# EAGLE schematic NBESlab_tES_Fusion_Schematic (EAGLE 9.7.0)
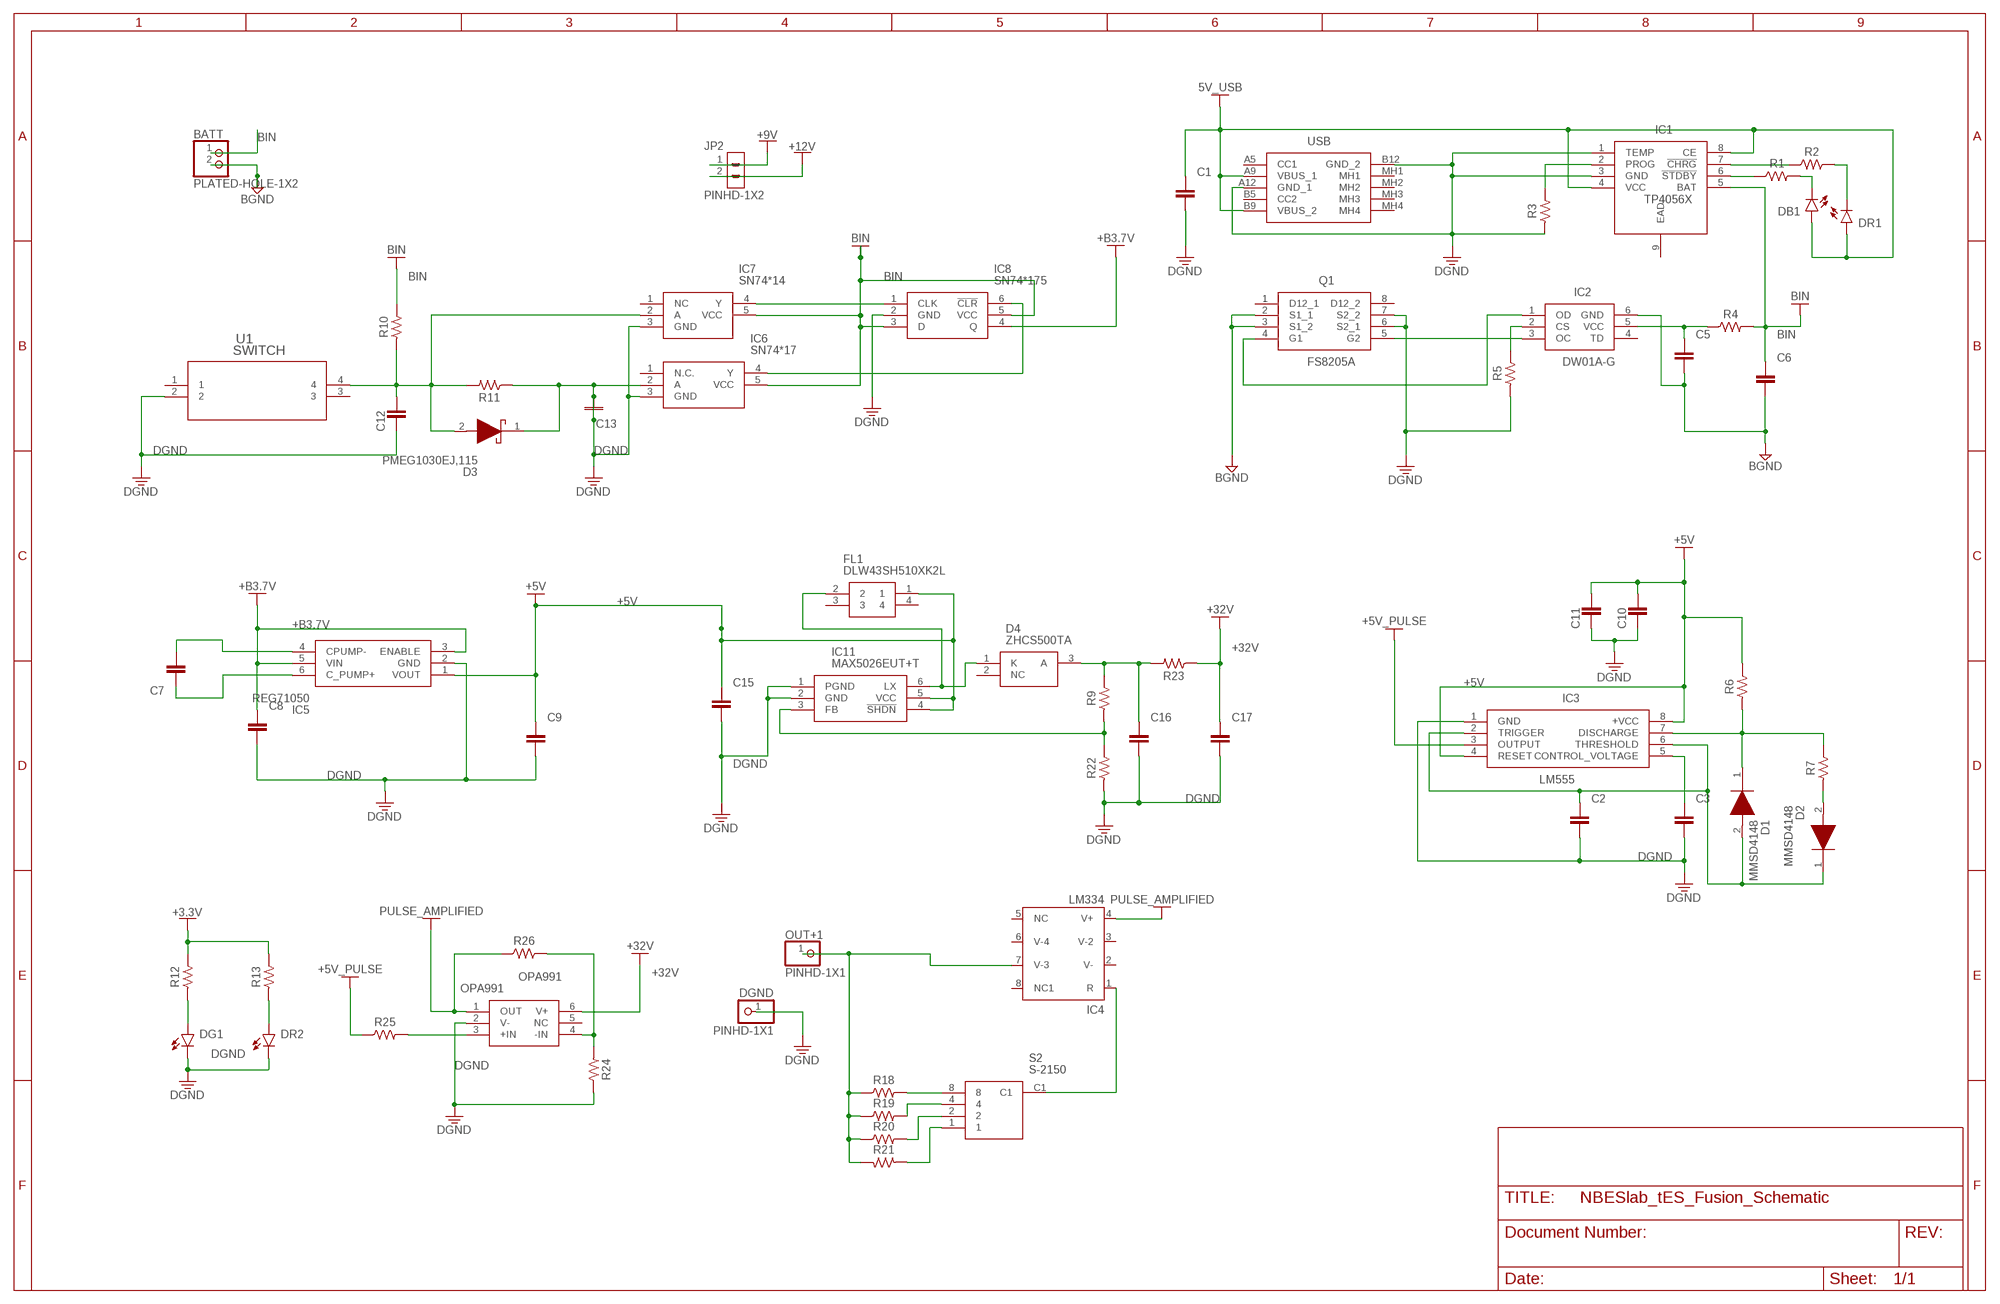
[diagram p0: schematic, sheet 1]

## Parts
BATT  PLATED-HOLE-1X2  [1X02]
C1  C_CHIP-0603(1608-METRIC)  [CAPC1608X85]
C2  C_CHIP-0603(1608-METRIC)  [CAPC1608X85]
C3  C_CHIP-0603(1608-METRIC)  [CAPC1608X85]
C5  C_CHIP-0603(1608-METRIC)  [CAPC1608X85]
C6  C_CHIP-0603(1608-METRIC)  [CAPC1608X85]
C7  C_CHIP-0402(1005-METRIC)  [CAPC1005X60]
C8  C_CHIP-0603(1608-METRIC)  [CAPC1608X85]
C9  C_CHIP-0603(1608-METRIC)  [CAPC1608X85]
C10  C_CHIP-0603(1608-METRIC)  [CAPC1608X85]
C11  C_CHIP-0603(1608-METRIC)  [CAPC1608X85]
C12  C_CHIP-0603(1608-METRIC)  [CAPC1608X85]
C13  C_CHIP-0805(2012-METRIC)  [CAPC2012X110]
C15  C_CHIP-0603(1608-METRIC)  [CAPC1608X85]
C16  C_CHIP-0603(1608-METRIC)  [CAPC1608X85]
C17  C_CHIP-0603(1608-METRIC)  [CAPC1608X85]
D1  MMSD4148  [SOD3716X135N]
D2  MMSD4148  [SOD3716X135N]
D3  PMEG1030EJ,115  [PMEG1030EJ115]
D4  ZHCS500TA  [SOT96P240X110-3N]
DB1  LED_BLUE  CHIP-FLAT-B_0805  [LEDC2012X110N_FLAT-B]
DG1  LED_BLUE  CHIP-FLAT-B_0805  [LEDC2012X110N_FLAT-B]
DGND  PINHD-1X1  [1X01]
DR1  LED_BLUE  CHIP-FLAT-B_0805  [LEDC2012X110N_FLAT-B]
DR2  LED_BLUE  CHIP-FLAT-B_0805  [LEDC2012X110N_FLAT-B]
FL1  DLW43SH510XK2L  [DLW43SH110XK2K]
IC1  TP4056X  [SOIC127P600X175-9N]
IC2  DW01A-G  [SOT95P280X135-6N]
IC3  LM555  LM555CM_NOPB  [SOIC127P600X175-8N]
IC4  LM334  [SO-08]
IC5  REG71050  REG71050DDCR  [SOT95P280X110-6N]
IC6  SN74*17  SN74LVC1G17DBVR  [SOT95P280X145-5N]
IC7  SN74*14  SN74LVC1G14DBVR  [SOT95P280X145-5N]
IC8  SN74*175  SN74LVC1G175DCKRDBVR  [SOT95P280X145-6N]
IC11  MAX5026EUT+T  [SOT95P280X145-6N]
JP2  PINHD-1X2  [1X02]
OPA991  OPA991  OPA991SIDBVROPA991SIDBVR  [SOT95P280X145-6N]
OUT+1  PINHD-1X1  [1X01]
Q1  FS8205A  [SOP65P640X120-8N]
R1  R-US_CHIP-0603(1608-METRIC)  [RESC1608X60]
R2  R-US_CHIP-0603(1608-METRIC)  [RESC1608X60]
R3  R-US_CHIP-0603(1608-METRIC)  [RESC1608X60]
R4  R-US_CHIP-0603(1608-METRIC)  [RESC1608X60]
R5  R-US_CHIP-0603(1608-METRIC)  [RESC1608X60]
R6  R-US_CHIP-0603(1608-METRIC)  [RESC1608X60]
R7  R-US_CHIP-0603(1608-METRIC)  [RESC1608X60]
R9  R-US_CHIP-0603(1608-METRIC)  [RESC1608X60]
R10  R-US_CHIP-0603(1608-METRIC)  [RESC1608X60]
R11  R-US_CHIP-0603(1608-METRIC)  [RESC1608X60]
R12  R-US_CHIP-0603(1608-METRIC)  [RESC1608X60]
R13  R-US_CHIP-0603(1608-METRIC)  [RESC1608X60]
R18  R-US_CHIP-0603(1608-METRIC)  [RESC1608X60]
R19  R-US_CHIP-0603(1608-METRIC)  [RESC1608X60]
R20  R-US_CHIP-0603(1608-METRIC)  [RESC1608X60]
R21  R-US_CHIP-0603(1608-METRIC)  [RESC1608X60]
R22  R-US_CHIP-0603(1608-METRIC)  [RESC1608X60]
R23  R-US_CHIP-0603(1608-METRIC)  [RESC1608X60]
R24  R-US_CHIP-0603(1608-METRIC)  [RESC1608X60]
R25  R-US_CHIP-0603(1608-METRIC)  [RESC1608X60]
R26  R-US_CHIP-0603(1608-METRIC)  [RESC1608X60]
S2  S-2150  [S2150]
U1  SWITCH  1571563-9SWITCH_1571563-9-L  [SWITCH_1571563-9-L]
USB  USB4125-GF-A-0190  [USB4125GFA0190]

## Nets
5V_USB: C1.1 DB1.A DR1.A IC1.4(VCC) IC1.8(CE) USB.A9(VBUS_1) USB.B9(VBUS_2)
+5V: C9.1 C10.1 C11.1 C15.1 FL1.1 IC3.4(RESET) IC3.8(+VCC) IC5.1(VOUT) IC11.4(!SHDN) IC11.5(VCC) JP2.1 R6.2 ; supply symbol labelled +9V
+5V_PULSE: IC3.3(OUTPUT) R25.1
+32V: C17.1 JP2.2 OPA991.6(V+) R23.1 ; supply symbol labelled +12V
+B3.7V: C8.1 IC5.3(ENABLE) IC5.5(VIN) IC8.4(Q) R12.2 R13.2 ; supply symbol labelled +3.3V
BGND: BATT.2 C5.2 C6.2 C10.2 C11.2 IC2.6(GND) Q1.2(S1_1) Q1.3(S1_2) ; supply symbol labelled DGND
BIN: BATT.1 C6.1 IC1.5(BAT) IC6.5(VCC) IC7.5(VCC) IC8.3(D) IC8.5(VCC) R4.2 R10.2
DGND: C1.2 C2.2 C3.2 C8.2 C9.2 C12.2 C13.1 C13.2 C15.2 C16.2 C17.2 D3.1(K) DG1.C DGND.1 DR2.C IC1.1(TEMP) IC1.3(GND) IC3.1(GND) IC5.2(GND) IC6.2(A) IC6.3(GND) IC7.3(GND) IC8.2(GND) IC11.1(PGND) IC11.2(GND) OPA991.2(V-) Q1.6(S2_1) Q1.7(S2_2) R3.1 R5.1 R11.1 R22.1 R24.2 U1.2 USB.A12(GND_1) USB.B12(GND_2)
N$1: C2.1 D1.2(A) D2.1(K) IC3.2(TRIGGER) IC3.6(THRESHOLD)
N$2: D1.1(K) IC3.7(DISCHARGE) R6.1 R7.2
N$3: C3.1 IC3.5(CONTROL_VOLTAGE)
N$4: D2.2(A) R7.1
N$5: D4.1(K) FL1.2 IC11.6(LX)
N$6: IC4.1(R) S2.C1
N$8: IC1.7(!CHRG) R2.1
N$9: IC1.6(!STDBY) R1.1
N$10: DB1.C R1.2
N$11: DR1.C R2.2
N$12: C12.1 D3.2(A) IC7.2(A) R10.1 R11.2 U1.4
N$13: C7.2 IC5.4(CPUMP-)
N$14: IC2.3(OC) Q1.5(G2)
N$15: IC2.1(OD) Q1.4(G1)
N$16: IC2.2(CS) R5.2
N$17: C7.1 IC5.6(C_PUMP+)
N$18: C16.1 D4.3(A) R9.2 R23.2
N$19: C5.1 IC2.5(VCC) R4.1
N$21: IC6.4(Y) IC8.6(!CLR)
N$22: IC7.4(Y) IC8.1(CLK)
N$23: DG1.A R12.1
N$24: DR2.A R13.1
N$25: IC1.2(PROG) R3.2
N$30: R18.2 S2.8
N$31: IC11.3(FB) R9.1 R22.2
N$32: OPA991.3(+IN) R25.2
N$33: OPA991.4(-IN) R24.1 R26.2
N$34: R19.2 S2.4
N$35: R20.2 S2.2
N$37: R21.1 S2.1
OUT+1: IC4.7(V-3) OUT+1.1 R18.1 R19.1 R20.1 R21.2
PULSE_AMPLIFIED: IC4.4(V+) OPA991.1(OUT) R26.1
Unconnected: D4.2(NC) FL1.3 FL1.4 IC1.9(EAD) IC2.4(TD) IC4.2(V-) IC4.3(V-2) IC4.5(NC) IC4.6(V-4) IC4.8(NC1) IC6.1(N.C.) IC7.1(NC) OPA991.5(NC) Q1.1(D12_1) Q1.8(D12_2) U1.1 U1.3 USB.A5(CC1) USB.B5(CC2) USB.MH1 USB.MH2 USB.MH3 USB.MH4

## Library data of the parts
BATT = tDCS Library:PLATED-HOLE-1X2: PIN HEADER; CATEGORY: CONNECTOR; SUB-CATEGORY: PIN-HEADER
C1-C3 C5-C12 C15-C17 = Capacitor:C: Capacitor - Generic; CATEGORY: Capacitor
C13 = Capacitor:C: Capacitor - Generic; CATEGORY: Capacitor; PACKAGE_SIZE: 0805; PACKAGE_TYPE: Surface Mount; SUBCATEGORY: Ceramic Capacitors; TYPE: MLCC
D1 D2 = tDCS Library:MMSD4148: Source: Datasheet <http://www.onsemi.com/pub/Collateral/MMSD4148T1-D.PDF>; ARROW_PART_NUMBER: MMSD4148T3G; ARROW_PRICE-STOCK: https://www.arrow.com/en/products/mmsd4148t3g/on-semiconductor?region=nac; HEIGHT: 1.35mm; MANUFACTURER_NAME: onsemi; MANUFACTURER_PART_NUMBER: MMSD4148T3G; MOUSER_PART_NUMBER: 863-MMSD4148T3G; MOUSER_PRICE-STOCK: https://www.mouser.co.uk/ProductDetail/onsemi/MMSD4148T3G?qs=P4IOph%252Bbot9it%2F8cCSipaQ%3D%3D
D3 = tDCS Library:PMEG1030EJ,115: Schottky Diodes & Rectifiers SCHOTTKY 10V 3A Source: Datasheet <https://assets.nexperia.com/documents/data-sheet/PMEG1030EH_EJ.pdf>; ARROW_PART_NUMBER: PMEG1030EJ,115; ARROW_PRICE-STOCK: https://www.arrow.com/en/products/pmeg1030ej115/nexperia?region=asia; DESCRIPTION: Schottky Diodes & Rectifiers SCHOTTKY 10V 3A; HEIGHT: 0.8mm; MANUFACTURER_NAME: Nexperia; MANUFACTURER_PART_NUMBER: PMEG1030EJ,115; MOUSER_PART_NUMBER: 771-PMEG1030EJ-T/R; MOUSER_PRICE-STOCK: https://www.mouser.co.uk/ProductDetail/Nexperia/PMEG1030EJ115?qs=LOCUfHb8d9vmk7P%2FuYbs5A%3D%3D
D4 = tDCS Library:ZHCS500TA: Schottky Diodes & Rectifiers VR=40V IF=500mA IR=40uA Source: Datasheet <https://www.diodes.com/assets/Datasheets/ZHCS500.pdf>; DESCRIPTION: Schottky Diodes & Rectifiers VR=40V IF=500mA IR=40uA; HEIGHT: 1.1mm; MANUFACTURER_NAME: Diodes Inc.; MANUFACTURER_PART_NUMBER: ZHCS500TA; MOUSER_PART_NUMBER: 522-ZHCS500TA; MOUSER_PRICE-STOCK: https://www.mouser.co.uk/ProductDetail/Diodes-Incorporated/ZHCS500TA?qs=%2F4dsY8i%2FUxLCpXiE%252BQsu9g%3D%3D
DB1 DG1 DR1 DR2 = tDCS Library:CHIP-FLAT-B; CATEGORY: LED; COLOR: BLUE; DESCRIPTION: CHIP LED FLAT; SUB-CATEGORY: CHIP; TYPE: FLAT_TOP
DGND OUT+1 = Connector:PINHD-1X1: PIN HEADER; CATEGORY: Headers; DESCRIPTION: Header, Straight, 1 Position; MANUFACTURER: Generic; MPN: Generic; OPERATING_TEMPERATURE: Generic; PART_STATUS: Active; PITCH: 0.100" (2.54mm); ROHS_COMPLIANCE: Generic; SERIES: Generic; SUB-CATEGORY: Headers, Male Pins; TYPE: Board to Board or Cable, Unshrouded, Through Hole, Straight
FL1 = tDCS Library:DLW43SH510XK2L: 1812 SMD Common Mode Choke 230mA 51uH DLW43S Common Mode Choke, -40 +125 C, 4.5 x 3.2 x 2.6mm Source: Datasheet <https://www.murata.com/en-us/products/productdetail?partno=DLW43SH510XK2#>; DESCRIPTION: 1812 SMD Common Mode Choke 230mA 51uH DLW43S Common Mode Choke, -40 +125 C, 4.5 x 3.2 x 2.6mm; HEIGHT: 2.8mm; MANUFACTURER_NAME: Murata Electronics; MANUFACTURER_PART_NUMBER: DLW43SH510XK2L; MOUSER_PART_NUMBER: 81-DLW43SH510XK2L; MOUSER_PRICE-STOCK: https://www.mouser.co.uk/ProductDetail/Murata-Electronics/DLW43SH510XK2L?qs=%2F%252BYoplLUB5gqIXi5PiNF7A%3D%3D
IC1 = tDCS Library:TP4056X: PMIC - Battery Management SOP-8_EP_150mil RoHS Source: Datasheet <https://datasheet.lcsc.com/szlcsc/Nanjing-Extension-Microelectronics-TP4056X_C191323.pdf>; DESCRIPTION: PMIC - Battery Management SOP-8_EP_150mil RoHS; HEIGHT: 1.75mm; MANUFACTURER_NAME: Nanjing Extension Microelectronics; MANUFACTURER_PART_NUMBER: TP4056X
IC2 = tDCS Library:DW01A-G: One Cell Lithium-ion/Polymer Battery Protection IC Source: Datasheet <http://acoptex.com/uploads/DW01A.pdf>; DESCRIPTION: One Cell Lithium-ion/Polymer Battery Protection IC; HEIGHT: 1.35mm; MANUFACTURER_NAME: Fortune Semiconductor Corporation; MANUFACTURER_PART_NUMBER: DW01A-G
IC3 = tDCS Library:LM555CM_NOPB: Highly stable 555 timer for generating accurate time delays and oscillation Source: Datasheet <http://www.ti.com/lit/ds/symlink/lm555.pdf>; DESCRIPTION: Highly stable 555 timer for generating accurate time delays and oscillation; HEIGHT: 1.75mm; MANUFACTURER_NAME: Texas Instruments; MANUFACTURER_PART_NUMBER: LM555CM/NOPB; MOUSER_PART_NUMBER: 926-LM555CM/NOPB; MOUSER_PRICE-STOCK: https://www.mouser.co.uk/ProductDetail/Texas-Instruments/LM555CM-NOPB?qs=QbsRYf82W3Hc3mLUToU1xw%3D%3D
IC4 = texas:LM334: CHARGE MANAGEMENT IC; MF: TEXAS INSTRUMENTS; MPN: BQ2002TSN; OC_FARNELL: 1564910; OC_NEWARK: 74C7527
IC5 = tDCS Library:REG71050DDCR: 60-mA, 5.0-V, Buck/Boost Charge Pump in ThinSOT-23 Source: Datasheet <http://www.ti.com/lit/gpn/REG71050>; ARROW_PART_NUMBER: REG71050DDCR; ARROW_PRICE-STOCK: https://www.arrow.com/en/products/reg71050ddcr/texas-instruments; DESCRIPTION: 60-mA, 5.0-V, Buck/Boost Charge Pump in ThinSOT-23; HEIGHT: 1.1mm; MANUFACTURER_NAME: Texas Instruments; MANUFACTURER_PART_NUMBER: REG71050DDCR; MOUSER_PART_NUMBER: 595-REG71050DDCR; MOUSER_PRICE-STOCK: https://www.mouser.co.uk/ProductDetail/Texas-Instruments/REG71050DDCR?qs=sSOk4GDDv7w%2FF3O8izAevQ%3D%3D
IC6 = tDCS Library:SN74LVC1G17DBVR: SINGLE SCHMITT-TRIGGER BUFFER Source: Datasheet <http://www.ti.com/lit/gpn/sn74lvc1g17>; DESCRIPTION: SINGLE SCHMITT-TRIGGER BUFFER; HEIGHT: 1.45mm; MANUFACTURER_NAME: Texas Instruments; MANUFACTURER_PART_NUMBER: SN74LVC1G17DBVR; MOUSER_PART_NUMBER: 595-SN74LVC1G17DBVR; MOUSER_PRICE-STOCK: https://www.mouser.co.uk/ProductDetail/Texas-Instruments/SN74LVC1G17DBVR?qs=fvkeCqCHl3BQIcdbAa1fbQ%3D%3D
IC7 = tDCS Library:SN74LVC1G14DBVR: TEXAS INSTRUMENTS - SN74LVC1G14DBVR - IC, SCHMITT TRIGGER INVERTER, SMD Source: Datasheet <https://datasheet.datasheetarchive.com/originals/distributors/Datasheets-DGA13/1136296.pdf>; DESCRIPTION: TEXAS INSTRUMENTS - SN74LVC1G14DBVR - IC, SCHMITT TRIGGER INVERTER, SMD; HEIGHT: 1.45mm; MANUFACTURER_NAME: Texas Instruments; MANUFACTURER_PART_NUMBER: SN74LVC1G14DBVR; MOUSER_PART_NUMBER: 595-SN74LVC1G14DBVR; MOUSER_PRICE-STOCK: https://www.mouser.co.uk/ProductDetail/Texas-Instruments/SN74LVC1G14DBVR?qs=dT9u2OTAaVWRIgCrQFnxuQ%3D%3D
IC8 = tDCS Library:SN74LVC1G175DCKR: Single D-Type Flip-Flop with Asynchronous Clear Source: Datasheet <http://www.ti.com/lit/gpn/sn74lvc1g175>
IC11 = tDCS Library:MAX5026EUT+T: Maxim MAX5026EUT+T, Step Up DC-DC Converter, Adjustable, 4 36 V, 6-Pin SOT-23 Source: Datasheet <https://datasheets.maximintegrated.com/en/ds/MAX5025-MAX5028.pdf>; DESCRIPTION: Maxim MAX5026EUT+T, Step Up DC-DC Converter, Adjustable, 4 36 V, 6-Pin SOT-23; HEIGHT: 1.45mm; MANUFACTURER_NAME: Maxim Integrated; MANUFACTURER_PART_NUMBER: MAX5026EUT+T; MOUSER_PART_NUMBER: 700-MAX5026EUTT; MOUSER_PRICE-STOCK: https://www.mouser.co.uk/ProductDetail/Maxim-Integrated/MAX5026EUT%2bT?qs=Mqkh4jHMT8zfiFUMsw6rrA%3D%3D
JP2 = Connector:PINHD-1X2: Pin Header; CATEGORY: Connectors; DESCRIPTION: Header-Straight-2 Position; PACKAGE_TYPE: Through Hole; PITCH: 0.100" (2.54mm); SUBCATEGORY: Headers; TYPE: Male Pins
OPA991 = tDCS Library:OPA991SIDBVR: Operational Amplifiers - Op Amps 40-V, single 4.5MHz, rail-to-rail input/output, low-offset-voltage, low-noise op amp 6-SOT-23 -40 to 125 Source: Datasheet <https://www.ti.com/lit/ds/symlink/opa991.pdf?ts=1607603409077&ref_url=https%3A%2F%2Fwww.ti.com%2Fstore%2Fti%2Fen%2Fp%2Fproduct%2F%3Fp%3DOPA991SIDBVR>
Q1 = tDCS Library:FS8205A: Dual N-Channel Enahncement Mode Power MOSFET Source: Datasheet <http://www.ic-fortune.com/upload/Download/FS8205A-DS-12_EN.pdf>; DESCRIPTION: Dual N-Channel Enahncement Mode Power MOSFET; HEIGHT: 1.2mm; MANUFACTURER_NAME: fortune; MANUFACTURER_PART_NUMBER: FS8205A
R1-R7 R9-R13 R18-R26 = Resistor:R-US: Resistor Fixed - ANSI; CATEGORY: Resistors; DESCRIPTION: Chip Resistor 1.60 X 0.82 X 0.60 mm body 0603(1608-METRIC) Package; PACKAGE_SIZE: 0603; PACKAGE_TYPE: Surface Mount
S2 = S-2150:S-2150: Copal Electronics S-2050, 4 Position SP4T Rotary Switch, 100 mA, Solder Source: Datasheet <https://www.nidec-copal-electronics.com/e/catalog/switch/ss-10&s-2050.pdf>; DESCRIPTION: Copal Electronics S-2050, 4 Position SP4T Rotary Switch, 100 mA, Solder; HEIGHT: 7mm; MANUFACTURER_NAME: Copal Electronics; MANUFACTURER_PART_NUMBER: S-2150
U1 = Switches:1571563-9; BUILT_BY: EMA_UL_Team; CATEGORY: Tactile Switches; COPYRIGHT: Copyright (C) 2016 Accelerated Designs. All rights reserved; DESCRIPTION: FSM8JSMATR=TACT,SMT,T&R; MANUFACTURER_PART_NUMBER: 1571563-9; PART_STATUS: active; SERIES: Alcoswitch Tactile FSM JSM; VENDOR: TE Connectivity
USB = tDCS Library:USB4125-GF-A-0190: USB Connectors USB C Rec GF RA 6P SMT TH Stakes 1.9mm Source: Datasheet <https://eu.mouser.com/datasheet/2/837/usb4125-2448699.pdf>; DESCRIPTION: USB Connectors USB C Rec GF RA 6P SMT TH Stakes 1.9mm; HEIGHT: 3.41mm; MANUFACTURER_NAME: GCT (GLOBAL CONNECTOR TECHNOLOGY); MANUFACTURER_PART_NUMBER: USB4125-GF-A-0190; MOUSER_PART_NUMBER: 640-USB4125-GF-A-190; MOUSER_PRICE-STOCK: https://www.mouser.co.uk/ProductDetail/GCT/USB4125-GF-A-0190?qs=QNEnbhJQKvbCz4hEJBS24w%3D%3D